# EAGLE design room1121 (EAGLE 9.4.2)
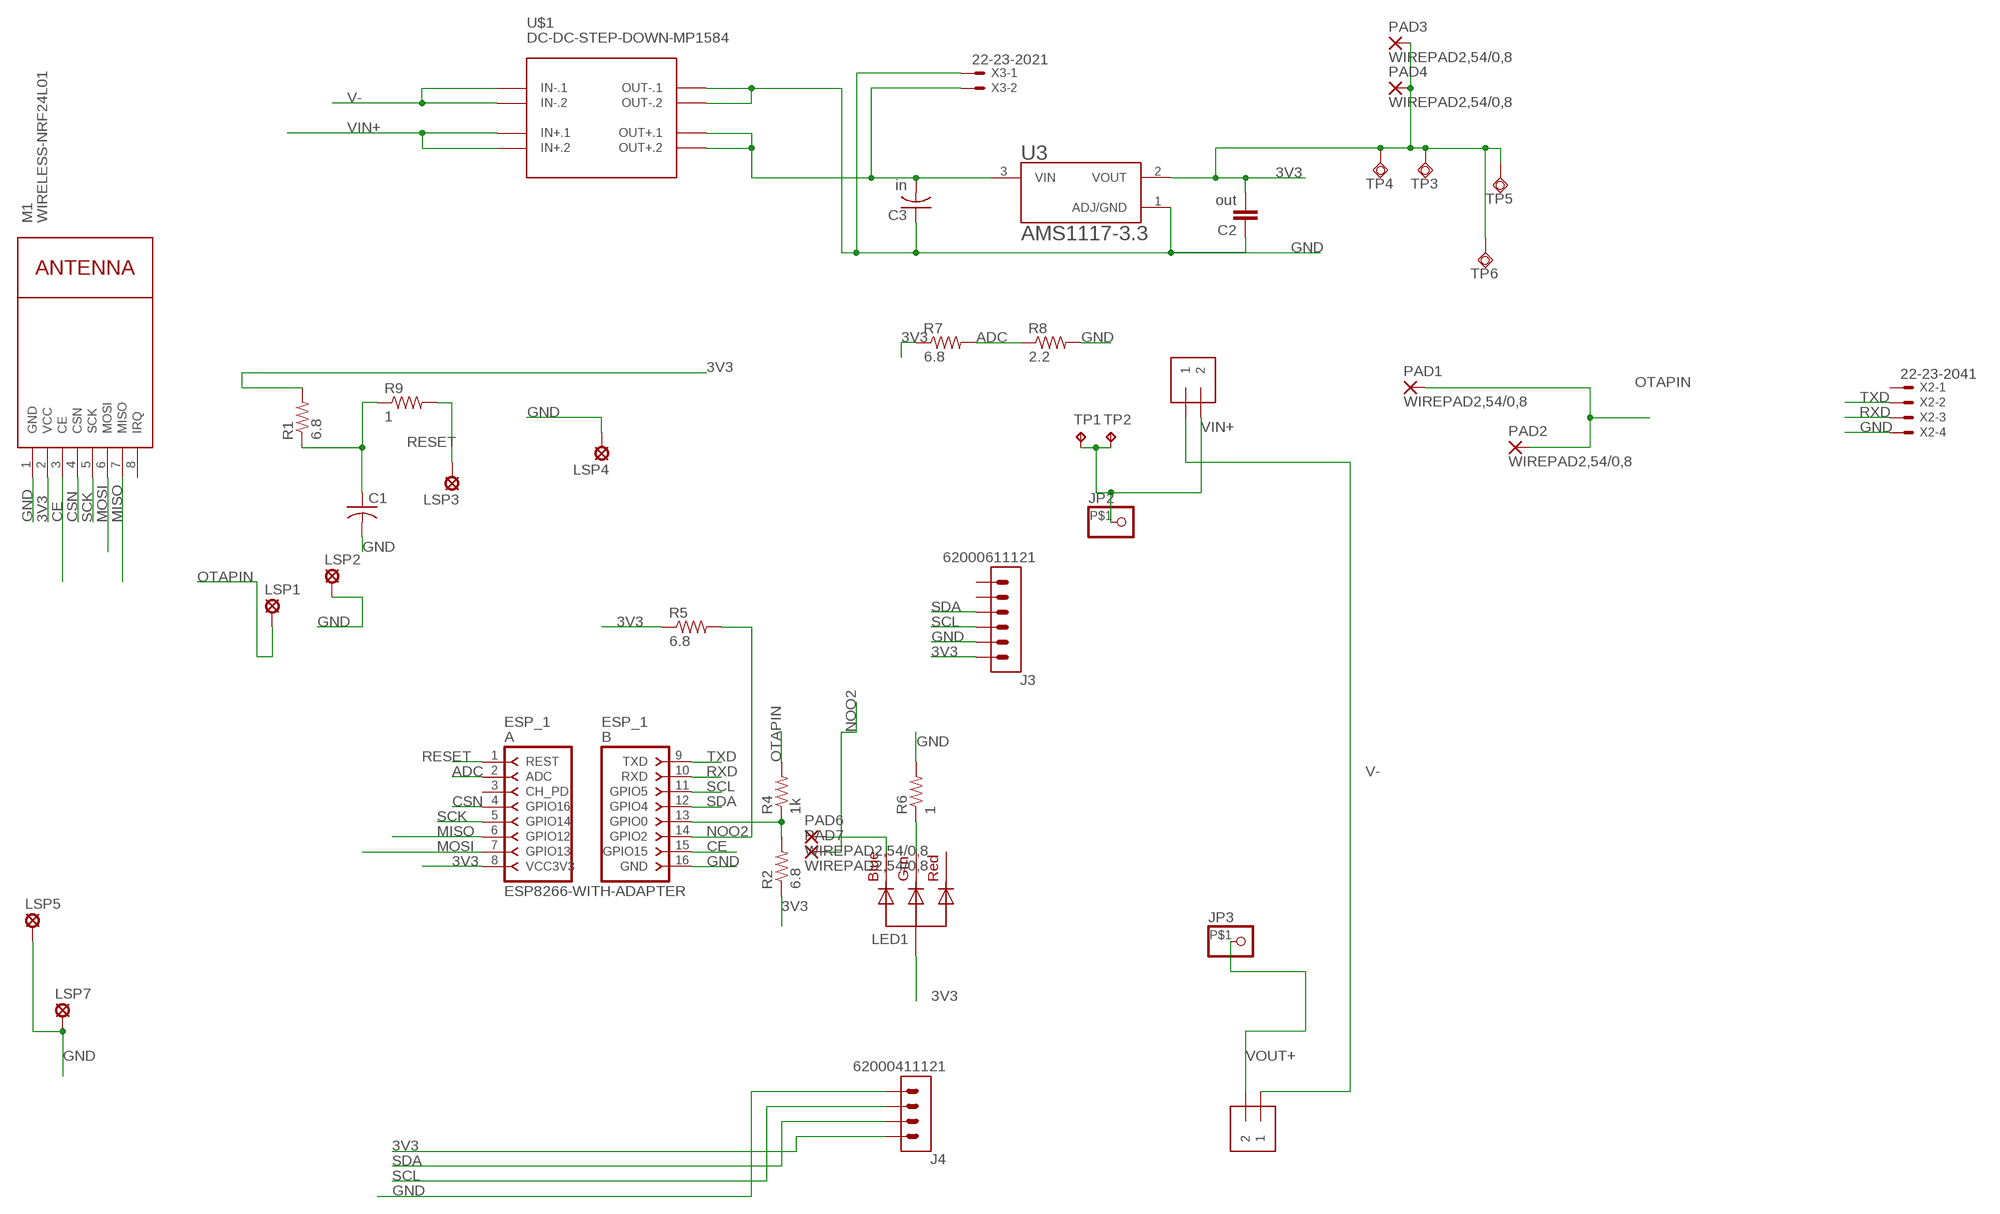
[diagram p0: schematic, sheet 1]

## Parts
C1  C-US025-040X050  [C025-040X050]
C2  out  C-EU025-060X050  [C025-060X050]
C3  in  C-US075-032X103  [C075-032X103]
ESP_1  ESP8266-WITH-ADAPTER  [ESP8266-ADAPTER]
J1  1X2-3.5MM  [1X2-3.5MM]
J2  1X2-3.5MM  [1X2-3.5MM]
J3  62000611121  [62000611121]
J4  62000411121  [62000411121]
JP2  PINHD-1X1-BIGPOGO  [1X1-BIGPOGO]
JP3  PINHD-1X1-BIGPOGO  [1X1-BIGPOGO]
LED1  RGBLED_CA-5MM  [LED5MMRGB]
LSP1  SE14  [SE14]
LSP2  SE14  [SE14]
LSP3  SE14  [SE14]
LSP4  SE14  [SE14]
LSP5  MCS10B  [MCS10B]
LSP7  MCS10B  [MCS10B]
M1  WIRELESS-NRF24L01  [WIRELESS-NRF24L01]
PAD1  WIREPAD2,54/0,8  [2,54/0,8]
PAD2  WIREPAD2,54/0,8  [2,54/0,8]
PAD3  WIREPAD2,54/0,8  [2,54/0,8]
PAD4  WIREPAD2,54/0,8  [2,54/0,8]
PAD6  WIREPAD2,54/0,8  [2,54/0,8]
PAD7  WIREPAD2,54/0,8  [2,54/0,8]
R1  6.8  R-US_0207/15  [0207/15]
R2  6.8  R-US_0207/15  [0207/15]
R4  1k  R-US_0207/15  [0207/15]
R5  6.8  R-US_0207/12  [0207/12]
R6  1  R-US_0207/10  [0207/10]
R7  6.8  R-US_0207/12  [0207/12]
R8  2.2  R-US_0207/15  [0207/15]
R9  1  R-US_0207/12  [0207/12]
TP1  TPPAD1-20Y  [P1-20Y]
TP2  TPPAD1-20Y  [P1-20Y]
TP3  TPSQPAD1-13Y  [P1-13Y]
TP4  TPSQPAD1-13Y  [P1-13Y]
TP5  TPSQPAD1-13Y  [P1-13Y]
TP6  TPSQPAD1-13Y  [P1-13Y]
U3  AMS1117-3.3  [SOT229P700X180-4N]
U$1  DC-DC-STEP-DOWN-MP1584  [DC-DC-STEP-DOWN-MP1584]
X2  22-23-2041  [22-23-2041]
X3  22-23-2021  [22-23-2021]

## Nets
3V3: C2.2 ESP_1.8(VCC3V3) J3.1 J4.1 LED1.2(VCC) M1.2(VCC) PAD3.1(P) PAD4.1(P) R1.2 R2.1 R5.1 R7.1 TP3.TP TP4.TP TP5.TP TP6.TP U3.2(VOUT)
ADC: ESP_1.2(ADC) R7.2 R8.1
CE: ESP_1.15(GPIO15) M1.3(CE)
CSN: ESP_1.4(GPIO16) M1.4(CSN)
GND: C1.2 C2.1 C3.1 ESP_1.16(GND) J3.2 J4.4 LSP2.MP LSP4.MP LSP5.MP LSP7.MP M1.1(GND) R6.2 R8.2 U3.1(ADJ/GND) U$1.OUT-.1 U$1.OUT-.2 X2.4 X3.1
MISO: ESP_1.6(GPIO12) M1.7(MISO)
MOSI: ESP_1.7(GPIO13) M1.6(MOSI)
N$1: LED1.3(GREEN) R6.1
N$2: ESP_1.13(GPIO0) R2.2 R4.1
N$4: C3.2 U3.3(VIN) U$1.OUT+.1 U$1.OUT+.2 X3.2
N$5: LED1.4(BLUE) PAD6.1(P)
N$9: LSP3.MP R9.2
NOO2: ESP_1.14(GPIO2) PAD7.1(P) R5.2
OTAPIN: LSP1.MP PAD1.1(P) PAD2.1(P) R4.2
RESET: C1.1 ESP_1.1(REST) R1.1 R9.1
RXD: ESP_1.10(RXD) X2.3
SCK: ESP_1.5(GPIO14) M1.5(SCK)
SCL: ESP_1.11(GPIO5) J3.3 J4.3
SDA: ESP_1.12(GPIO4) J3.4 J4.2
TXD: ESP_1.9(TXD) X2.2
V-: J1.1 J2.1 U$1.IN-.1 U$1.IN-.2
VIN+: J2.2 JP2.P$1 TP1.TP TP2.TP U$1.IN+.1 U$1.IN+.2
VOUT+: J1.2 JP3.P$1
Unconnected: ESP_1.3(CH_PD) J3.5 J3.6 LED1.1(RED) M1.8(IRQ) X2.1

## Library data of the parts
C1 C3 = adafruit:C-US: CAPACITOR, American symbol
C2 = rcl:C-EU: CAPACITOR, European symbol; SPICEPREFIX: C
ESP_1 = esp8266_with_adapter:ESP8266-WITH-ADAPTER: ESP8266 Adapter for ESP8266-03, ESP8266-04, ESP8266-07, ESP8266-08, ESP8266-12 and similar. (c) by Bartosz Batorek obi--wan@wp.pl
J1 J2 = adafruit:1X2: 3.5mm Terminal block http://www.ladyada.net/library/pcb/eaglelibrary.html
J3 = Headers:62000611121: THT Vertical Pin Header WR-PHD, Pitch 2.00 mm, Single Row, 6 pins Manufacturer's datasheet <https://datasheet.octopart.com/62000611121-W%C3%BCrth-Elektronik-datasheet-117282008.pdf>; CREATED_BY: PCBLayout.com; MANUFACTURER: Würth Elektronik; MPN: 62000611121
J4 = Headers:62000411121: THT Vertical Pin Header WR-PHD, Pitch 2.00 mm, Single Row, 4 pins Manufacturer's datasheet <https://datasheet.octopart.com/62000411121-W%C3%BCrth-Elektronik-datasheet-117282003.pdf>; CREATED_BY: PCBLayout.com; MANUFACTURER: Würth Elektronik; MPN: 62000411121
JP2 JP3 = adafruit:PINHD-1X1: Pin header 1x1 for 0.1" spacing With round pins
LED1 = adafruit:RGBLED_CA: RGB LED, common-anode 5MM Staggered pins 5mm Piranha package http://www.ladyada.net/library/pcb/eaglelibrary.html
LSP1-LSP4 = solpad:SE14: SOLDER PAD E1553, drill 1,4mm, distributor Buerklin, 07F820
LSP5 LSP7 = solpad:MCS10B: SOLDER PAD MC S1, distributor Buerklin, 15F505
M1 = diy-modules:WIRELESS-NRF24L01: 2.4 GHz Wireless Module based on NRF24L01 chip More details available here: http://www.electrodragon.com/w/NRF24L01 Click here to find device on ebay.com <http://www.ebay.com/sch/nrf24l01+arduino>
PAD1-PAD4 PAD6 PAD7 = wirepad:WIREPAD: Wire PAD connect wire on PCB
R1 R4 R8 = rCCl:R-US_: RESISTOR, American symbol; SPICEPREFIX: R
R2 R5-R7 R9 = adafruit:R-US_: RESISTOR, American symbol
TP1 TP2 = testpad:TP: Test pad
TP3-TP6 = testpad:TPSQ: Test pad
U3 = AMS1117-3.3:AMS1117-3.3: Sot223/Pkg 1-Amp 3.3-Volt Low Drop Out Voltage Regulatator; AVAILABILITY: Unavailable; DESCRIPTION: Sot223/Pkg 1-Amp 3.3-Volt Low Drop Out Voltage Regulatator; MF: Advanced Monolithic Systems; MP: AMS1117-3.3; PACKAGE: None; PRICE: None
U$1 = diy-modules:DC-DC-STEP-DOWN-MP1584: DC/DC Step-Down Regulator based on MP1584 chip MP1584 datasheet available here: http://www.haoyuelectronics.com/Attachment/MP1584/MP1584.pdf Click here to find device on ebay.com <http://www.ebay.com/sch/mp1584+module>
X2 = con-molex:22-23-2041: .100" (2.54mm) Center Header - 4 Pin; MF: MOLEX; MPN: 22-23-2041; OC_FARNELL: 1462920; OC_NEWARK: 38C0355
X3 = con-molex:22-23-2021: .100" (2.54mm) Center Header - 2 Pin; MF: MOLEX; MPN: 22-23-2021; OC_FARNELL: 1462926; OC_NEWARK: 25C3832

## Board
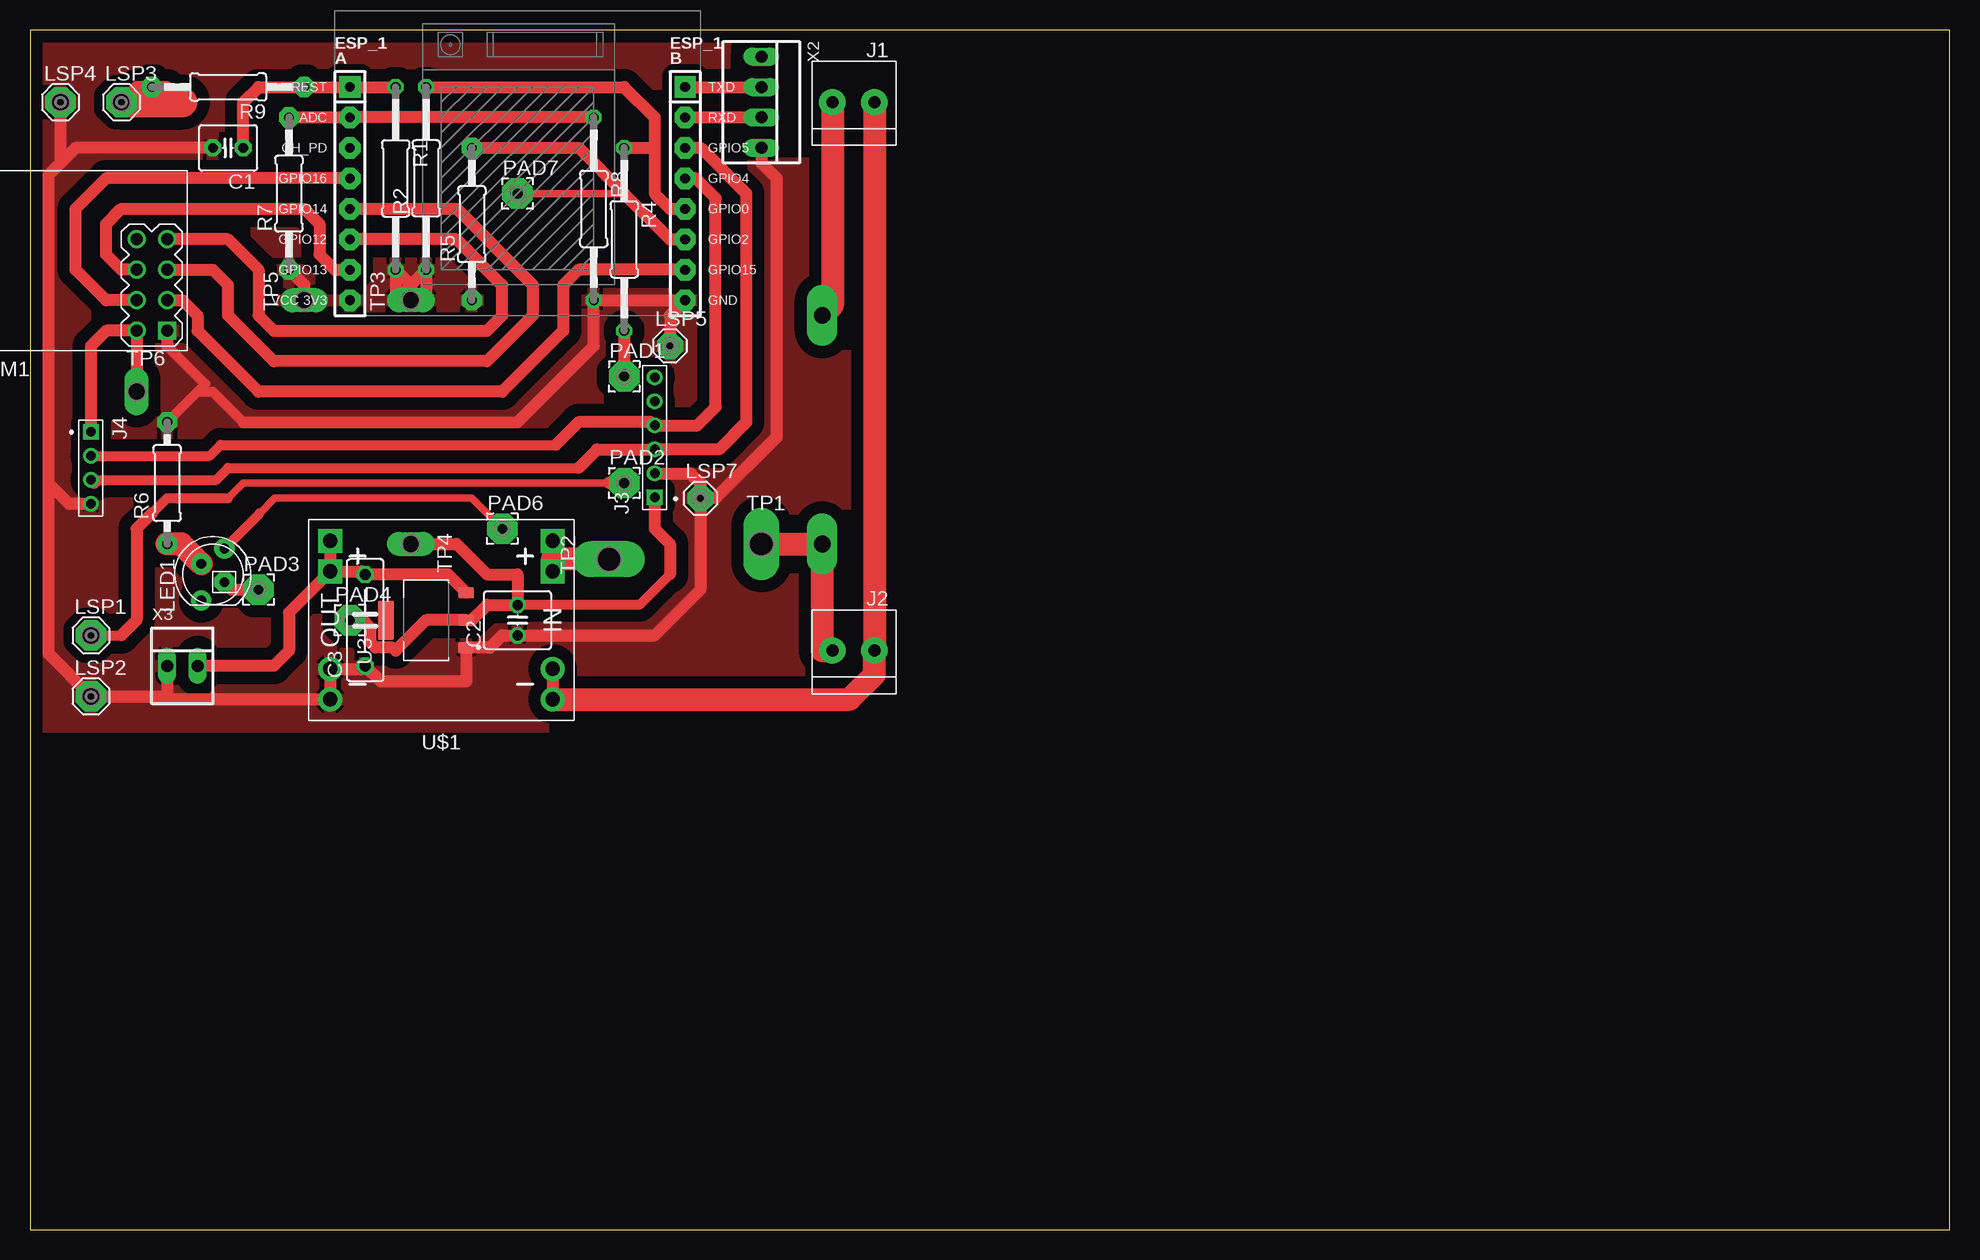
[diagram p1: board, top side]
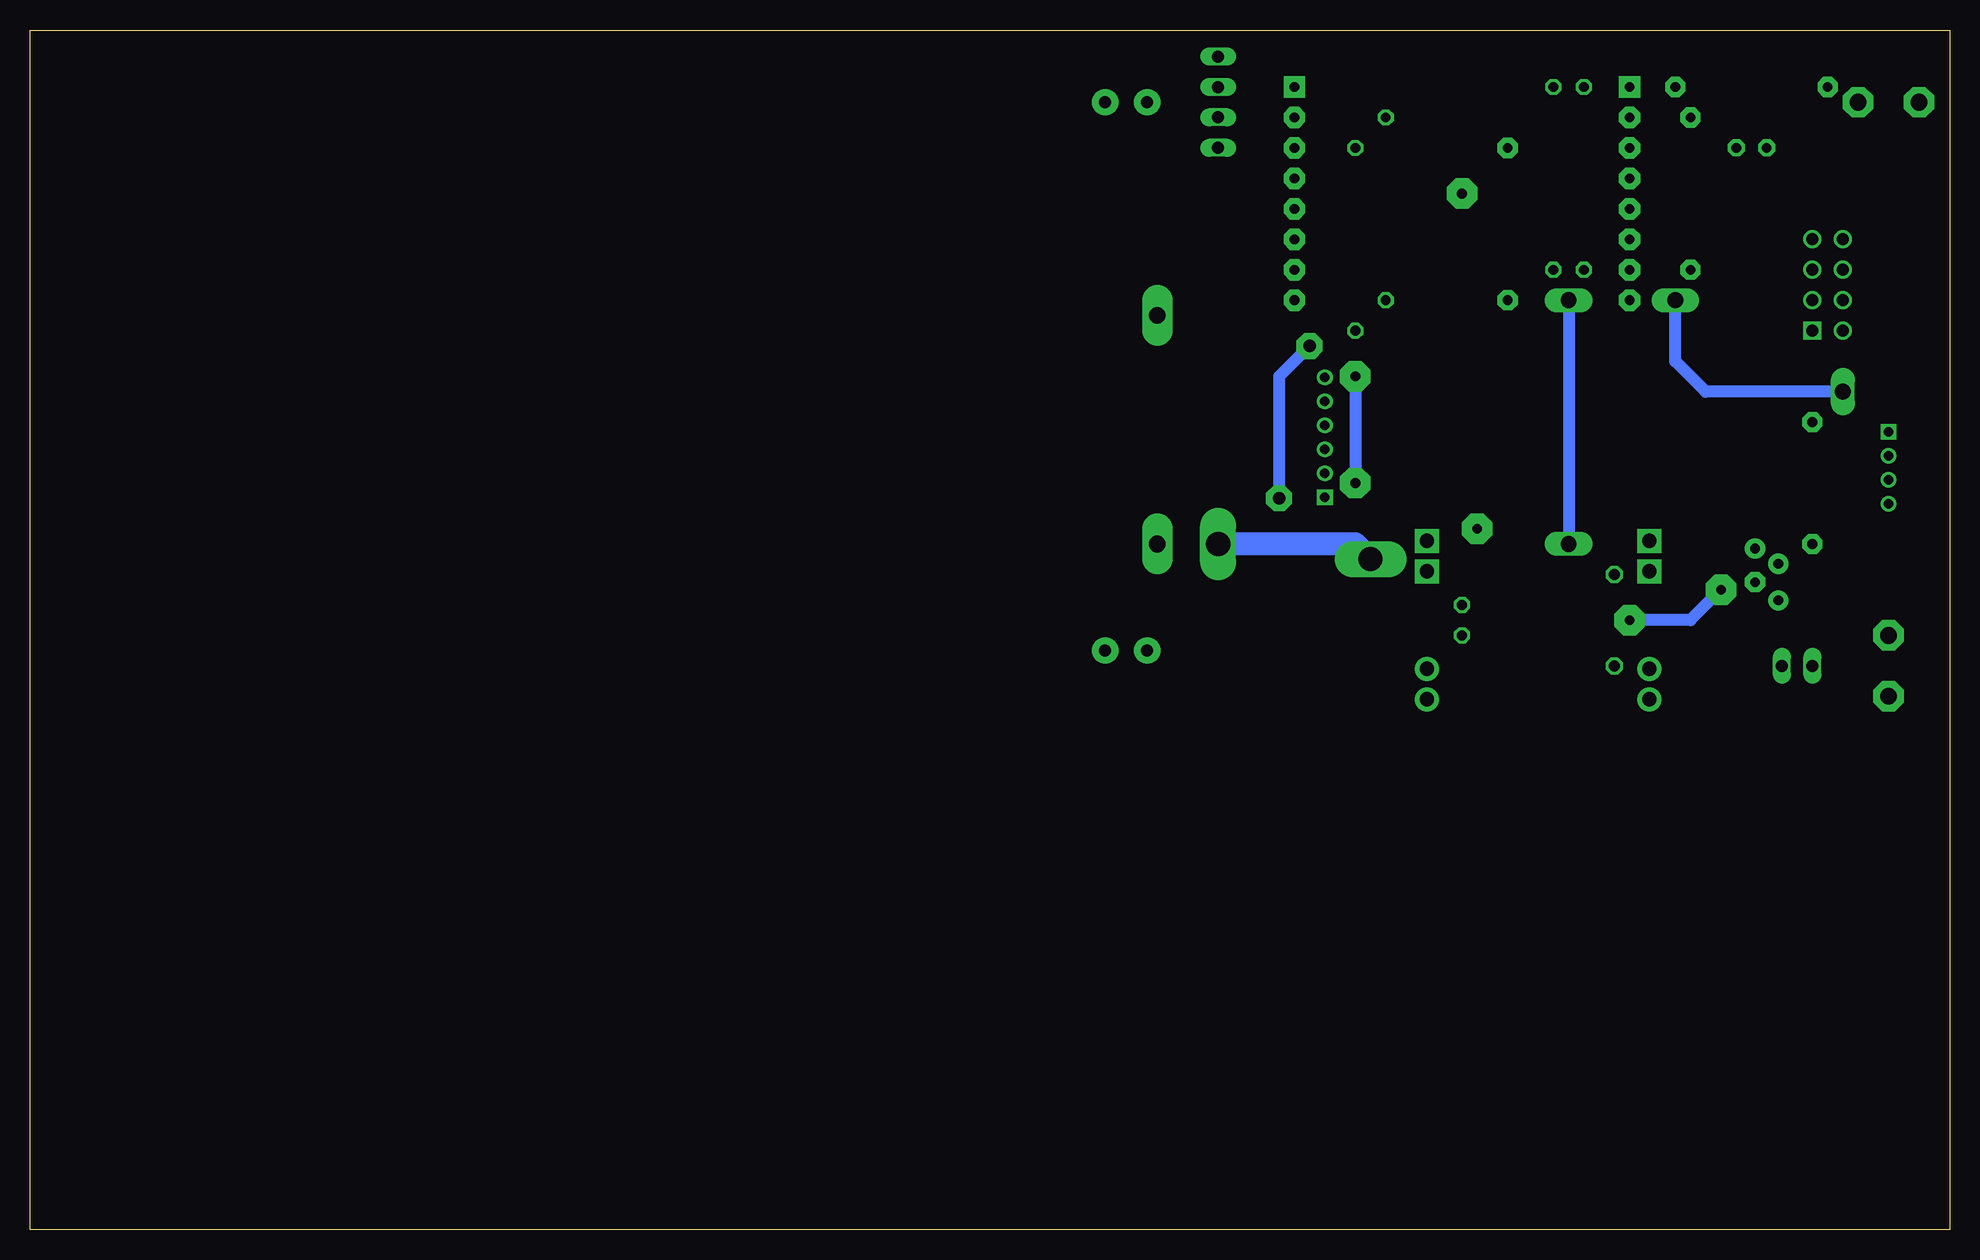
[diagram p2: board, bottom side, seen from below]

Size 160 x 100 mm. Coordinates in mm from the lower left corner, seen from the top.
Outline: 0,0 160,0 160,100 0,100 0,0
Copper layers (1*16): Top 0.035mm / dielectric 1.5mm / Bottom 0.035mm
Design rules "default": minimum track width 6mil, minimum drill 0.35mm, track to track 6mil, track to pad 6mil, pad to pad 6mil, via to via 6mil, smd to smd 6mil, copper to edge 40mil, drill to drill 6mil, minimum pad ring 10mil, minimum via ring 8mil, stop-mask expansion 4mil, vias tented up to drill 0mil, thermal gap 10mil

### Footprints (pad centres in the part's own frame; a part is rotated, then mirrored left to right if it is on the bottom)
C025-040X050 = drill 0.813 pad 1.422 octagon: 1 -1.27,0; 2 1.27,0
C025-060X050 = drill 0.813 octagon: 1 -1.27,0; 2 1.27,0
C075-032X103 = drill 0.914 octagon: 1 -3.81,0; 2 3.81,0
ESP8266-ADAPTER = drill 0.813 pad 1.778 square: 1 -13.97,8.89; 9 13.97,8.89 | drill 0.813 pad 1.778 octagon: 2 -13.97,6.35; 3 -13.97,3.81; 4 -13.97,1.27; 5 -13.97,-1.27; 6 -13.97,-3.81; 7 -13.97,-6.35; 8 -13.97,-8.89; 10 13.97,6.35; 11 13.97,3.81; 12 13.97,1.27; 13 13.97,-1.27; 14 13.97,-3.81; 15 13.97,-6.35; 16 13.97,-8.89
1X2-3.5MM = drill 1 pad 2.184: 1 1.8,0; 2 -1.7,0
62000611121 = drill 0.8 square: 1 -5,0 | drill 0.8: 2 -3,0; 3 -1,0; 4 1,0; 5 3,0; 6 5,0
62000411121 = drill 0.8 square: 1 -3,0 | drill 0.8: 2 -1,0; 3 1,0; 4 3,0
1X1-BIGPOGO = drill 1.4 pad 2.54 long: P$1 0,0
LED5MMRGB = drill 0.8 pad 1.676: 1 -2.159,0.968; 3 0.889,0.968; 4 2.159,-0.968 | drill 0.8 pad 1.676 octagon: 2 -0.635,-0.968
SE14 = drill 1.397 pad 2.54 octagon: MP 0,0
MCS10B = drill 1.016 pad 2.159 octagon: MP 0,0
WIRELESS-NRF24L01 = drill 1 square: 1 -12.7,6.35 | drill 1: 2 -10.16,6.35; 3 -12.7,3.81; 4 -10.16,3.81; 5 -12.7,1.27; 6 -10.16,1.27; 7 -12.7,-1.27; 8 -10.16,-1.27
2,54/0,8 = drill 0.813 pad 2.54 octagon: 1 0,0
0207/15 = drill 0.813 octagon: 1 -7.62,0; 2 7.62,0
0207/12 = drill 0.813 pad 1.676 octagon: 1 -6.35,0; 2 6.35,0
0207/10 = drill 0.813 pad 1.676 octagon: 1 -5.08,0; 2 5.08,0
P1-20Y = drill 2.007 pad 2.54 long: TP 0,0
P1-13Y = drill 1.321 pad 1.905 long: TP 0,0
SOT229P700X180-4N = smd 0.93 x 1.31: 1 -2.29,-3.345; 2 0,-3.345; 3 2.29,-3.345 | smd 3.24 x 1.31: 4 0,3.345
DC-DC-STEP-DOWN-MP1584 = drill 1.2 pad 2 square: IN+.1 -9.271,-4.064; IN+.2 -9.271,-6.604; OUT+.1 9.271,-4.064; OUT+.2 9.271,-6.604 | drill 1.2 pad 2: IN-.1 -9.271,6.604; IN-.2 -9.271,4.064; OUT-.1 9.271,6.604; OUT-.2 9.271,4.064
22-23-2041 = drill 1 long: 1 -3.81,0; 2 -1.27,0; 3 1.27,0; 4 3.81,0
22-23-2021 = drill 1 long: 1 -1.27,0; 2 1.27,0

### Placement (x,y rotation side)
C1  16.51,90.17 180 top
C2  40.64,50.8 90 top
C3  27.94,50.8 90 top
ESP_1  40.64,86.36 0 top
J1  68.58,93.98 0 top
J2  68.58,48.26 0 top
J3  52.07,66.04 90 top
J4  5.08,63.5 270 top
JP2  66.04,57.15 90 top
JP3  66.04,76.2 90 top
LED1  15.24,54.61 90 top
LSP1  5.08,49.53 0 top
LSP2  5.08,44.45 0 top
LSP3  7.62,93.98 0 top
LSP4  2.54,93.98 0 top
LSP5  53.34,73.66 0 top
LSP7  55.88,60.96 0 top
M1  -1.27,81.28 180 top
PAD1  49.53,71.12 0 top
PAD2  49.53,62.23 0 top
PAD3  19.05,53.34 0 top
PAD4  26.67,50.8 0 top
PAD6  39.37,58.42 0 top
PAD7  40.64,86.36 0 top
R1  30.48,87.63 270 top
R2  33.02,87.63 90 top
R4  49.53,82.55 270 top
R5  36.83,83.82 90 top
R6  11.43,62.23 90 top
R7  21.59,86.36 90 top
R8  46.99,85.09 270 top
R9  16.51,95.25 180 top
TP1  60.96,57.15 0 top
TP2  48.26,55.88 90 top
TP3  31.75,77.47 90 top
TP4  31.75,57.15 270 top
TP5  22.86,77.47 90 top
TP6  8.89,69.85 0 top
U3  33.02,50.8 90 top
U$1  34.29,50.8 180 top
X2  60.96,93.98 270 top
X3  12.7,46.99 0 top

### Tracks (layer width: path | path; a pad name or v marks a point on that pad's centre or on a via)
3V3
  Top 0.813: 53.34,54.61 50.8,52.07 C2.2
  Top 1.016: J4.1 5.08,73.66 6.35,74.93 M1.2 TP6.TP | 53.34,54.61 53.34,57.15 52.07,58.42 J3.1 | LED1.2 16.84,53.34 PAD3.1 | PAD4.1 27.73,50.8 28.36,50.16 28.36,48.96 28.8,48.52 30.22,48.52 30.48,48.26 33.02,50.8 U3.2 36.83,50.8 38.1,52.07 C2.2 40.64,54.61 38.1,54.61 35.56,57.15 TP4.TP | R7.1 22.86,78.74 TP5.TP | 33.02,77.47 R2.1 30.48,77.47 R1.2 31.75,78.74 TP3.TP
  Bottom 1.016: TP3.TP TP4.TP | TP6.TP 20.32,69.85 22.86,72.39 TP5.TP | PAD3.1 21.59,50.8 PAD4.1
  pour Top (isolate 1.016): 17.78,83.82 17.78,80.01 19.05,78.74 19.05,76.2 20.32,74.93 38.1,74.93 39.37,76.2 39.37,78.74 35.56,82.55 25.4,82.55 24.13,83.82 21.59,83.82
ADC
  Top 1.016: R7.2 ESP_1.2 R8.1
CE
  Top 1.016: M1.3 12.7,77.47 13.97,76.2 13.97,74.93 19.05,69.85 39.37,69.85 44.45,74.93 44.45,78.74 45.72,80.01 ESP_1.15
CSN
  Top 1.016: M1.4 6.35,77.47 3.81,80.01 3.81,85.09 6.35,87.63 ESP_1.4
GND
  Top 0.813: 13.97,69.85 14.61,70.48 11.43,73.66 | 13.97,69.85 R6.2 | 13.97,69.85 15.24,69.85 17.78,67.31
  Top 1.016: C1.2 3.81,90.17 2.54,88.9 | 2.54,88.9 1.52,87.88 1.52,62.23 | 1.52,62.23 1.52,48.01 LSP2.MP 11.43,44.45 | J4.4 3.25,60.5 1.52,62.23 | LSP4.MP 2.54,88.9 | X3.1 11.43,44.45 | U$1.OUT-.2 25.27,46.99 | M1.1 11.43,73.66 | 17.78,67.31 40.64,67.31 46.99,73.66 R8.2 ESP_1.16 53.34,76.2 LSP5.MP | X2.4 60.96,88.9 62.23,87.63 62.23,66.04 57.15,60.96 LSP7.MP | J3.2 55.07,63.04 55.88,62.23 LSP7.MP | LSP7.MP 55.88,53.34 52.07,49.53 C2.1 39.37,49.53 38.35,48.51 U3.1 36.37,45.72 29.21,45.72 C3.1 27.69,46.74 U$1.OUT-.2 | U$1.OUT-.2 U$1.OUT-.1 11.68,44.2 11.43,44.45
  Bottom 1.016: LSP5.MP 55.88,71.12 LSP7.MP
  pour Top (isolate 1.016): 0,99.06 15.24,99.06 73.66,99.06 73.66,92.71 72.39,91.44 16.51,91.44 15.24,92.71 15.24,77.47 17.78,74.93 20.32,72.39 45.72,72.39 41.91,76.2 41.91,82.55 39.37,85.09 36.83,85.09 39.37,87.63 39.37,90.17 40.64,88.9 73.66,88.9 73.66,44.45 71.12,41.91 0,41.91
MISO
  Top 1.016: M1.7 16.51,82.55 19.05,80.01 19.05,76.2 20.32,74.93 38.1,74.93 39.37,76.2 39.37,78.74 35.56,82.55 ESP_1.6
MOSI
  Top 1.016: M1.6 7.62,80.01 6.35,81.28 6.35,83.82 7.62,85.09 22.86,85.09 24.13,83.82 24.13,81.28 25.4,80.01 ESP_1.7
N$1
  Top 1.905: LED1.3 12.62,57.15 R6.1
N$2
  Top 1.016: R2.2 49.53,95.25 52.07,92.71 52.07,90.17 | 52.07,90.17 52.07,86.36 53.34,85.09 ESP_1.13 | R4.1 52.07,90.17
N$4
  Top 1.016: U$1.OUT+.2 U$1.OUT+.1 | U3.3 34.84,54.61 C3.2 27.69,54.86 U$1.OUT+.1 | U$1.OUT+.1 21.59,51.44 21.59,48.26 20.32,46.99 X3.2
N$5
  Top 0.61: 19.13,59.69 20.4,60.96 35.56,60.96 36.83,60.96 PAD6.1
  Top 0.813: LED1.4 19.13,59.69
N$9
  Top 1.016: LSP3.MP 8.89,95.25 R9.2 11.43,95.25 12.7,93.98
  Top 2.54: LSP3.MP 12.7,93.98
NOO2
  Top 0.61: PAD7.1 49.53,86.36
  Top 1.016: R5.2 45.72,90.17 49.53,86.36 53.34,82.55 ESP_1.14
OTAPIN
  Top 0.61: 16.51,60.96 17.78,62.23 PAD2.1
  Top 0.813: LSP1.MP 7.62,49.53 | 10.16,59.69 11.43,60.96 16.51,60.96
  Top 1.016: 10.16,59.69 8.89,58.42 8.89,50.8 7.62,49.53 | R4.2 PAD1.1 | 48.26,62.23 PAD2.1
  Bottom 1.016: PAD1.1 PAD2.1
RESET
  Top 1.016: C1.1 17.78,93.98 19.05,95.25 R9.1 ESP_1.1 R1.1
RXD
  Top 1.016: ESP_1.10 X2.3
SCK
  Top 1.016: M1.5 15.24,80.01 16.51,78.74 16.51,76.2 20.32,72.39 38.1,72.39 41.91,76.2 41.91,78.74 35.56,85.09 ESP_1.5
SCL
  Top 0.813: J4.3 15.51,62.5 16.51,63.5 45.72,63.5
  Top 1.016: ESP_1.11 55.88,90.17 59.69,86.36 59.69,67.31 57.42,65.04 J3.3 47.26,65.04 45.72,63.5 | J4.3 5.35,62.23
SDA
  Top 0.813: J4.2 14.97,64.5 15.88,65.41 43.81,65.41
  Top 1.016: ESP_1.12 55.5,87.63 57.15,85.98 57.15,68.58 55.61,67.04 J3.4 51.8,67.31 45.72,67.31 43.81,65.41
TXD
  Top 1.016: ESP_1.9 X2.2
V-
  Top 1.016: U$1.IN-.2 U$1.IN-.1
  Top 1.905: J1.1 J2.1 70.38,46.25 68.33,44.2 U$1.IN-.1
VIN+
  Top 1.016: U$1.IN+.2 43.56,55.88 U$1.IN+.1
  Top 1.905: J2.2 66.04,48.26 JP2.P$1 TP1.TP | TP2.TP 43.56,55.88
  Bottom 1.905: TP2.TP 49.53,57.15 TP1.TP
VOUT+
  Top 1.905: J1.2 66.88,77.04 JP3.P$1